# Altium schematic sheet 18 PM8916_CODEC.SchDoc
size 868 x 576 mm
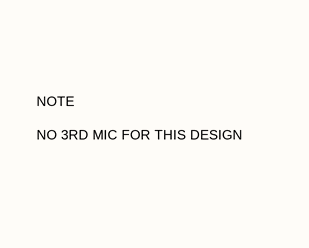
[diagram p0: 18 PM8916_CODEC.SchDoc, top left]
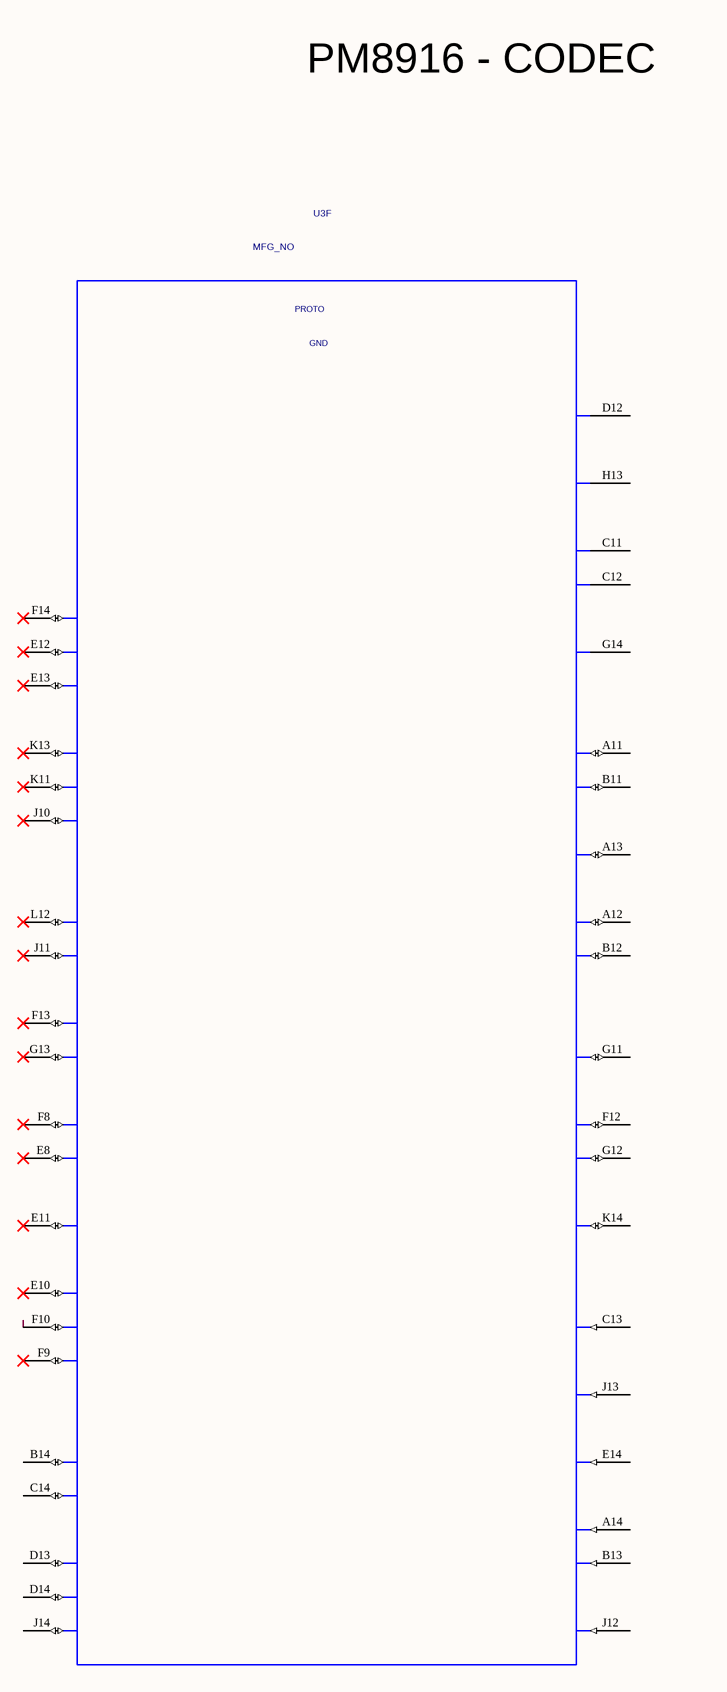
[diagram p1: 18 PM8916_CODEC.SchDoc, top middle]
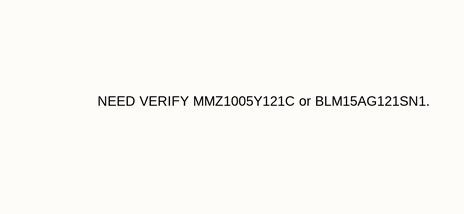
[diagram p2: 18 PM8916_CODEC.SchDoc, bottom left]
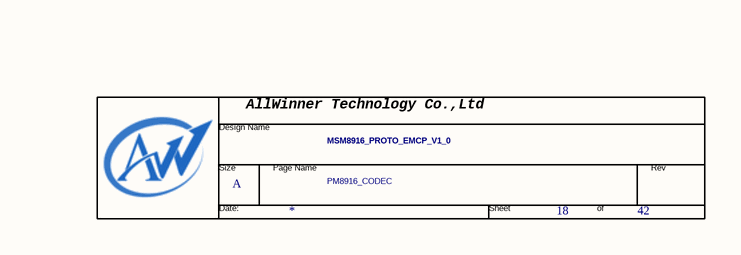
[diagram p3: 18 PM8916_CODEC.SchDoc, bottom right]

## Parts
*  Page Count: 42  Page Number: 18  Page Size: A  Title: MSM8916_PROTO_EMCP_V1_0  Doc: PM8916_CODEC  (hidden comment: TitleBlock0-AW)  (graphical)
U3  SYMNAME: GND  PART_ID: MFG_NO  BLOCKID: PROTO  [PM-8916-0-176NSP-TR-00-0]  (hidden comment: ASIC_PM8916)  (part F of 7)

## Nets

Not connected (* = marked no-connect by the designer): U3 A11(CDC_BOOST_VREG_5V_A) A12(CDC_BOOST_SW1) A13(CDC_VBAT) A14(CDC_GND_BOOST1) B11(CDC_BOOST_VREG_5V_B) B12(CDC_BOOST_SW2) B13(CDC_GND_BOOST2) B14(CDC_NCP_FLYP) C11(CDC_VDD_CP1) C12(CDC_VDD_CP2) C13(CDC_GND_CP) C14(CDC_NCP_FLYN) D12(CDC_VDDIO) D13(CDC_NCP_VNEG_1) D14(CDC_NCP_VNEG_2) E8(CDC_PDM_SYNC)* E10(CDC_PDM_RX0)* E11(CDC_PDM_TX)* E12(CDC_SPKDRV_M_1)* E13(CDC_SPKDRV_M_2)* E14(CDC_GND_SPKDRV) F8(CDC_PDM_CLK)* F9(CDC_PDM_RX2)* F10(CDC_PDM_RX1) F12(CDC_HPH_L) F13(CDC_EAR_P)* F14(CDC_SPKDRV_P)* G11(CDC_HPH_REF) G12(CDC_HPH_R) G13(CDC_EAR_M)* G14(CDC_VDD_SPKDRV) H13(CDC_VDD_PA) J10(CDC_IN3_P)* J11(CDC_MIC_BIAS2)* J12(CDC_REF_GND) J13(CDC_GND_CFILT) J14(CDC_PA_VNEG) K11(CDC_IN2_P)* K13(CDC_IN1_P)* K14(CDC_HS_DET) L12(CDC_MIC_BIAS1)*

## Notes on the sheet
- PM8916 - CODEC
- NOTE
- NO 3RD MIC FOR THIS DESIGN
- NEED VERIFY MMZ1005Y121C or BLM15AG121SN1.
- (in symbol TitleBlock0-AW) AllWinner Technology Co.,Ltd; Design Name; Size; Page Name; Rev; Date:; Sheet; of

## Library data of the parts
U3 = ASIC_PM8916: PART_NUMBER: MCN_NO; OriginalSymbolOrigin: (-1050,1125); SPLIT_INST: TRUE; CDS_LMAN_SYM_OUTLINE: -850,1125,875,-1250; CDS_LMAN_SPLIT_NUMBER: 1 of 7; PACK_TYPE: ?
* = TitleBlock0-AW: RevCode: ?; Page Create Date: March  8, 1995; Page Modify Date: *